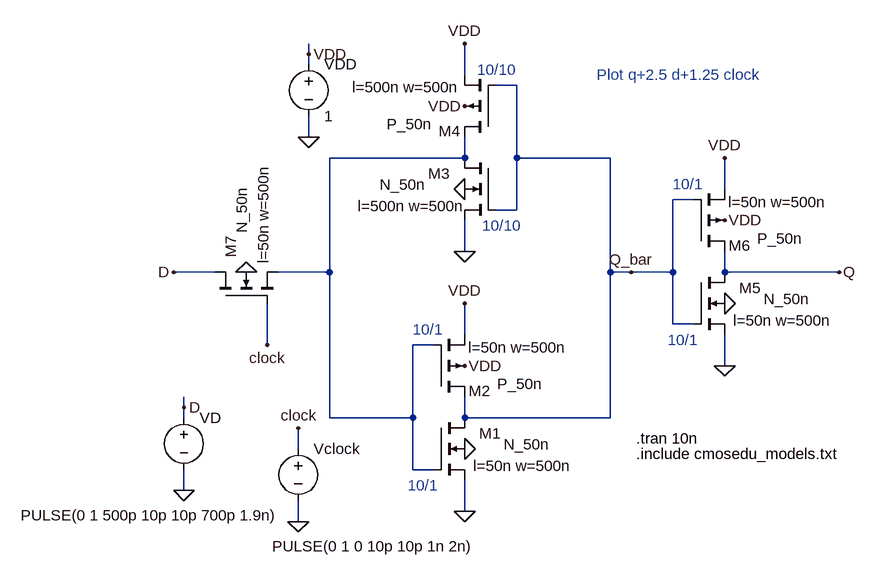
[diagram p0: schematic Fig13_19.asc]
Fig13_19.asc, the LTspice schematic file:
Version 4
SHEET 1 1136 680
WIRE 208 -736 208 -752
WIRE 208 -720 208 -736
WIRE 448 -704 448 -752
WIRE 528 -688 496 -688
WIRE 208 -608 208 -640
WIRE 448 -576 448 -608
WIRE 448 -576 240 -576
WIRE 528 -576 528 -688
WIRE 672 -576 528 -576
WIRE 848 -528 848 -576
WIRE 800 -512 768 -512
WIRE 528 -496 528 -576
WIRE 528 -496 496 -496
WIRE 448 -432 448 -480
WIRE 64 -400 0 -400
WIRE 240 -400 240 -576
WIRE 240 -400 160 -400
WIRE 672 -400 672 -576
WIRE 704 -400 672 -400
WIRE 768 -400 768 -512
WIRE 768 -400 704 -400
WIRE 848 -400 848 -432
WIRE 1024 -400 848 -400
WIRE 768 -320 768 -400
WIRE 800 -320 768 -320
WIRE 448 -304 448 -352
WIRE 144 -288 144 -352
WIRE 400 -288 368 -288
WIRE 848 -256 848 -304
WIRE 16 -192 16 -208
WIRE 16 -176 16 -192
WIRE 240 -176 240 -400
WIRE 368 -176 368 -288
WIRE 368 -176 240 -176
WIRE 448 -176 448 -208
WIRE 672 -176 672 -400
WIRE 672 -176 448 -176
WIRE 192 -128 192 -160
WIRE 368 -96 368 -176
WIRE 400 -96 368 -96
WIRE 16 -64 16 -96
WIRE 448 -32 448 -80
WIRE 192 -16 192 -48
FLAG 448 -128 0
FLAG 208 -608 0
FLAG 208 -736 VDD
FLAG 448 -256 VDD
FLAG 448 -32 0
FLAG 448 -352 VDD
FLAG 448 -528 0
FLAG 448 -656 VDD
FLAG 448 -432 0
FLAG 448 -752 VDD
FLAG 848 -352 0
FLAG 848 -480 VDD
FLAG 848 -256 0
FLAG 848 -576 VDD
FLAG 112 -400 0
FLAG 0 -400 D
FLAG 144 -288 clock
FLAG 1024 -400 Q
FLAG 16 -64 0
FLAG 16 -192 D
FLAG 192 -16 0
FLAG 192 -160 clock
FLAG 704 -400 Q_bar
SYMBOL nmos4 400 -176 R0
WINDOW 0 104 24 Right 2
WINDOW 3 179 41 Right 2
WINDOW 123 213 74 Right 2
SYMATTR InstName M1
SYMATTR Value N_50n
SYMATTR Value2 l=50n w=500n
SYMBOL voltage 208 -736 R0
WINDOW 123 0 0 Left 2
WINDOW 39 0 0 Left 2
SYMATTR InstName VDD
SYMATTR Value 1
SYMBOL pmos4 400 -208 M180
WINDOW 0 88 9 Right 2
WINDOW 3 168 20 Right 2
WINDOW 123 206 76 Right 2
SYMATTR InstName M2
SYMATTR Value P_50n
SYMATTR Value2 l=50n w=500n
SYMBOL nmos4 496 -576 M0
WINDOW 0 104 24 Right 2
WINDOW 3 179 41 Right 2
WINDOW 123 213 74 Right 2
SYMATTR InstName M3
SYMATTR Value N_50n
SYMATTR Value2 l=500n w=500n
SYMBOL pmos4 496 -608 R180
WINDOW 0 88 9 Right 2
WINDOW 3 168 20 Right 2
WINDOW 123 221 77 Right 2
SYMATTR InstName M4
SYMATTR Value P_50n
SYMATTR Value2 l=500n w=500n
SYMBOL nmos4 800 -400 R0
WINDOW 0 104 24 Right 2
WINDOW 3 179 41 Right 2
WINDOW 123 213 74 Right 2
SYMATTR InstName M5
SYMATTR Value N_50n
SYMATTR Value2 l=50n w=500n
SYMBOL pmos4 800 -432 M180
WINDOW 0 88 9 Right 2
WINDOW 3 168 20 Right 2
WINDOW 123 206 76 Right 2
SYMATTR InstName M6
SYMATTR Value P_50n
SYMATTR Value2 l=50n w=500n
SYMBOL nmos4 64 -352 R270
WINDOW 0 104 24 Right 2
WINDOW 3 179 41 Right 2
WINDOW 123 213 74 Right 2
SYMATTR InstName M7
SYMATTR Value N_50n
SYMATTR Value2 l=50n w=500n
SYMBOL voltage 16 -192 R0
WINDOW 123 0 0 Left 2
WINDOW 39 0 0 Left 2
WINDOW 3 -251 166 Left 2
SYMATTR Value PULSE(0 1 500p 10p 10p 700p 1.9n)
SYMATTR InstName VD
SYMBOL voltage 192 -144 R0
WINDOW 123 0 0 Left 2
WINDOW 39 0 0 Left 2
WINDOW 3 -40 166 Left 2
SYMATTR Value PULSE(0 1 0 10p 10p 1n 2n)
SYMATTR InstName Vclock
TEXT 712 -144 Left 2 !.tran 10n
TEXT 712 -120 Left 2 !.include cmosedu_models.txt
TEXT 368 -312 Left 2 ;10/1
TEXT 360 -72 Left 2 ;10/1
TEXT 904 -704 Right 2 ;Plot q+2.5 d+1.25 clock
TEXT 528 -712 Right 2 ;10/10
TEXT 536 -472 Right 2 ;10/10
TEXT 768 -536 Left 2 ;10/1
TEXT 760 -296 Left 2 ;10/1

The netlist it stands for:
* Fig13_19.asc
M1 Q_bar N001 0 0 N_50n l=50n w=500n
VDD VDD 0 1
M2 Q_bar N001 VDD VDD P_50n l=50n w=500n
M3 N001 Q_bar 0 0 N_50n l=500n w=500n
M4 N001 Q_bar VDD VDD P_50n l=500n w=500n
M5 Q Q_bar 0 0 N_50n l=50n w=500n
M6 Q Q_bar VDD VDD P_50n l=50n w=500n
M7 D clock N001 0 N_50n l=50n w=500n
VD D 0 PULSE(0 1 500p 10p 10p 700p 1.9n)
Vclock clock 0 PULSE(0 1 0 10p 10p 1n 2n)
.model NMOS NMOS
.model PMOS PMOS
.lib standard.mos
.tran 10n
.include cmosedu_models.txt
* 10/1
* 10/1
* Plot q+2.5 d+1.25 clock
* 10/10
* 10/10
* 10/1
* 10/1
.backanno
.end